# EAGLE design Particle2WeMos (EAGLE 7.5.0)
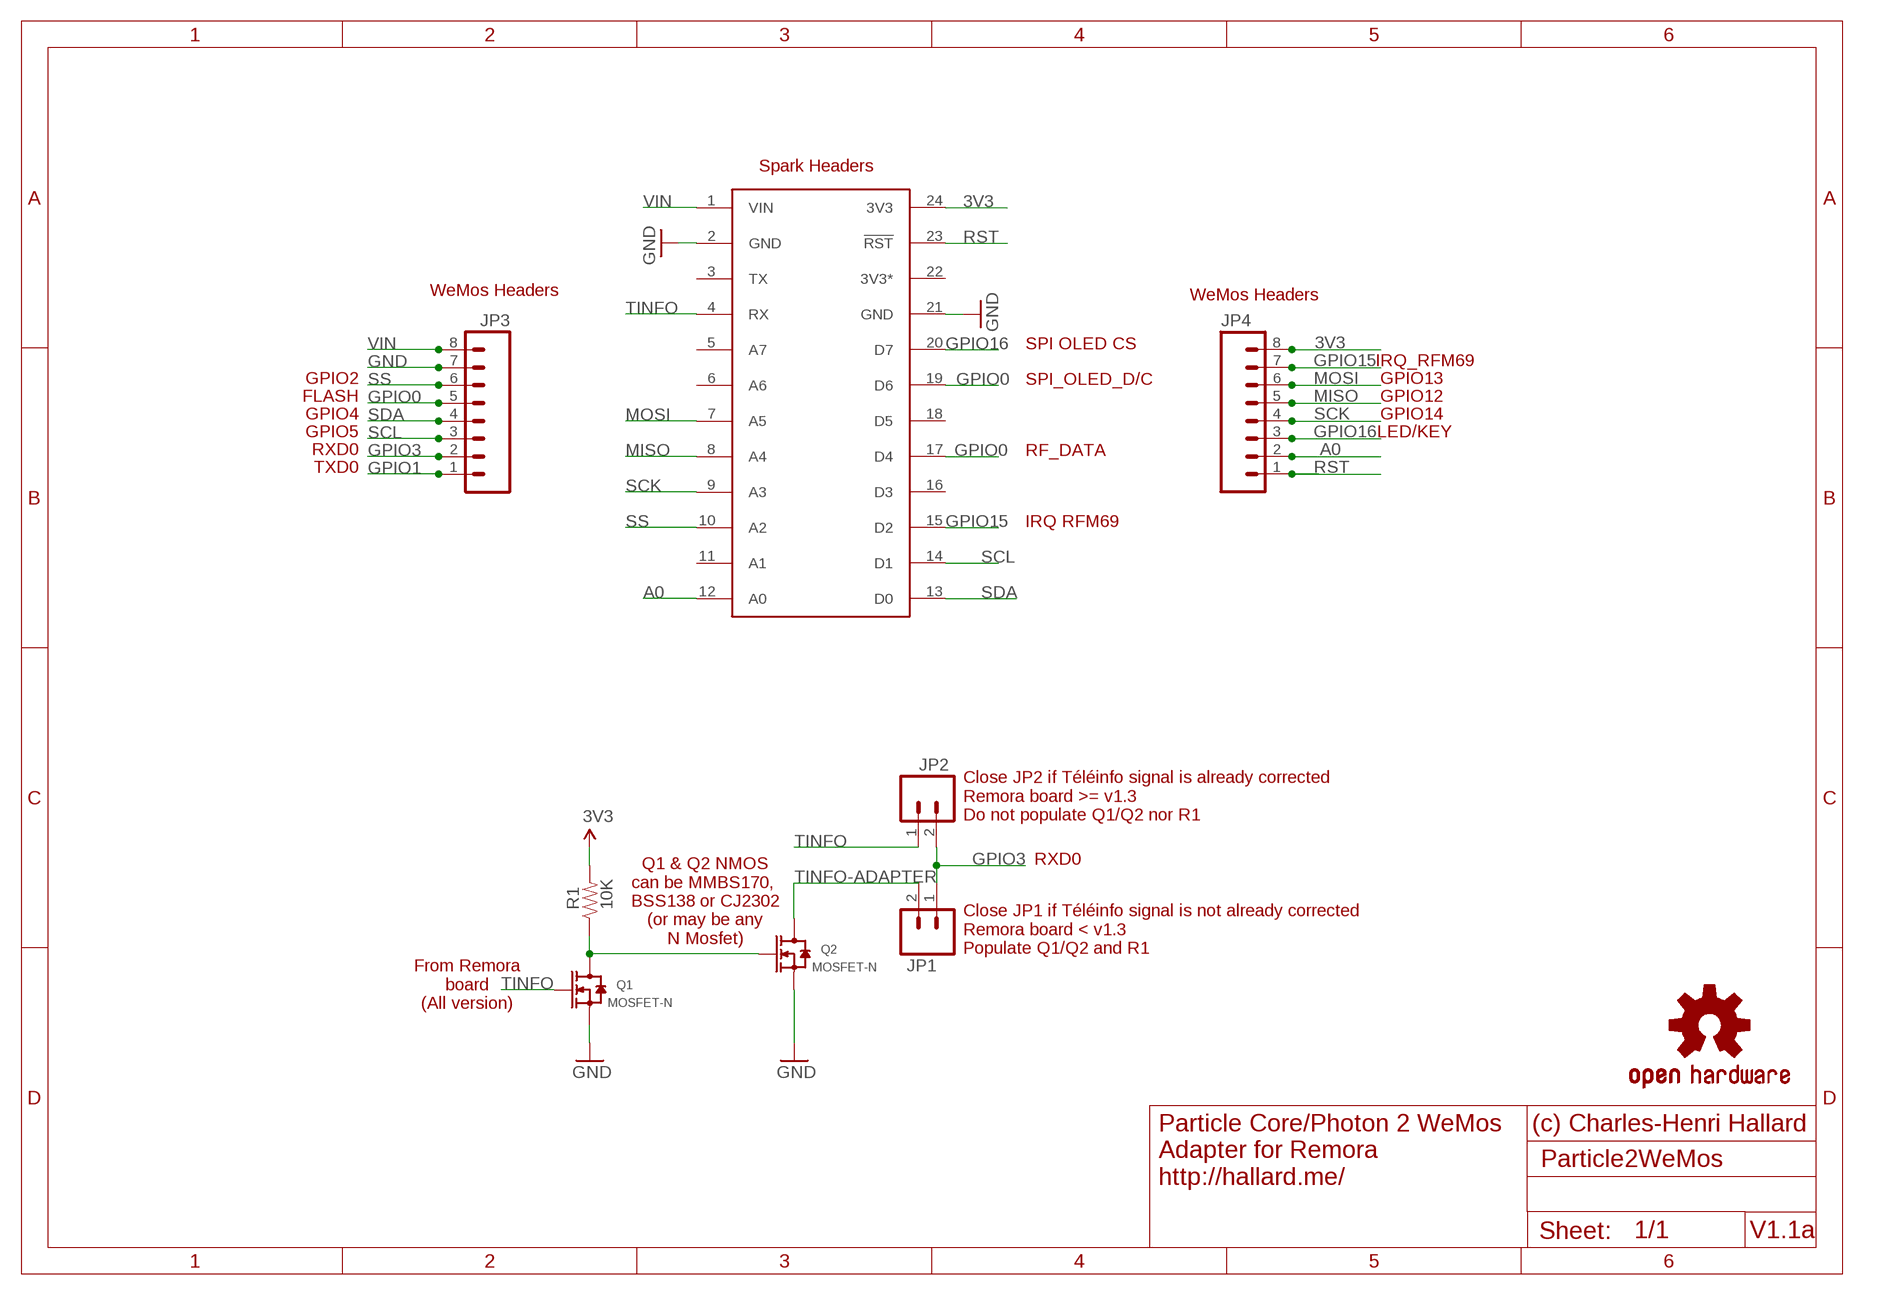
[diagram p0: schematic, sheet 1]

## Parts
JP1  M02LOCK  [1X02_LOCK]
JP2  M02LOCK  [1X02_LOCK]
JP3  M08SILK_FEMALE_PTH  [1X08]
JP4  M08SILK_FEMALE_PTH  [1X08]
LOGO1  OSHW-LOGOM  [OSHW-LOGO-M]
LOGO2  OSHW-LOGOM  [OSHW-LOGO-M]
Q1  MOSFET-N  MOSFET-N-''  [SOT23]
Q2  MOSFET-N  MOSFET-N-''  [SOT23]
R1  10K  RESISTOR0805-RES  [0805-RES]
U$2  SPARK_CORECORE  [SPARK_CORE]

## Nets
3V3: JP4.8 R1.2 U$2.24(3V3)
A0: JP4.2 U$2.12(A0)
GND: JP3.7 Q1.2(S) Q2.2(S) U$2.2(GND) U$2.21(GND)
GPIO0: JP3.5 U$2.17(D4) U$2.19(D6)
GPIO1: JP3.1
GPIO3: JP1.1 JP2.2 JP3.2
GPIO15: JP4.7 U$2.15(D2)
GPIO16: JP4.3 U$2.20(D7)
MISO: JP4.5 U$2.8(A4)
MOSI: JP4.6 U$2.7(A5)
N$3: Q1.3(D) Q2.1(G) R1.1
RST: JP4.1 U$2.23(!RST)
SCK: JP4.4 U$2.9(A3)
SCL: JP3.3 U$2.14(D1)
SDA: JP3.4 U$2.13(D0)
SS: JP3.6 U$2.10(A2)
TINFO: JP2.1 Q1.1(G) U$2.4(RX)
TINFO-ADAPTER: JP1.2 Q2.3(D)
VIN: JP3.8 U$2.1(VIN)
Unconnected: U$2.3(TX) U$2.5(A7) U$2.6(A6) U$2.11(A1) U$2.16(D3) U$2.18(D5)

## Notes on the sheet
- Spark Headers
- WeMos Headers | WeMos Headers
- SPI OLED CS | IRQ_RFM69
- GPIO2 | GPIO13
- FLASH | SPI_OLED_D/C | GPIO12
- GPIO4 | GPIO14
- GPIO5 | LED/KEY
- RXD0
- TXD0 | RF_DATA
- IRQ RFM69
- Close JP2 if Téléinfo signal is already corrected
  Remora board >= v1.3
  Do not populate Q1/Q2 nor R1
- RXD0
- Q1 & Q2 NMOS
  can be MMBS170, 
  BSS138 or CJ2302
  (or may be any
  N Mosfet)
- Close JP1 if Téléinfo signal is not already corrected
  Remora board < v1.3
  Populate Q1/Q2 and R1
- From Remora
  board
  (All version)
- (c) Charles-Henri Hallard
- Particle Core/Photon 2 WeMos
  Adapter for Remora
  http://hallard.me/
- V1.1a

## Power pins joined to a net without a drawn wire
3V3*: U$2.22(3V3*)

## Library data of the parts
JP1 JP2 = SparkFun-Connectors:M02: Standard 2-pin 0.1" header. Use with - straight break away headers ( PRT-00116) - right angle break away headers (PRT-00553) - swiss pins (PRT-00743) - machine pins (PRT-00117) - female headers (PRT-00115) Molex polarized connector foot print use with: PRT-08233 with associated crimp pins and housings. 2.54_SCREWTERM for use with PRT-10571. 3.5mm Screw Terminal footprints for PRT-08084 5mm Screw Terminal footprints for use with PRT-08432
JP3 JP4 = SparkFun-Connectors:M08: Header 8 Standard 8-pin 0.1" header. Use with straight break away headers (SKU : PRT-00116), right angle break away headers (PRT-00553), swiss pins (PRT-00743), machine pins (PRT-00117), and female headers (PRT-00115).; PROD_ID: CONN-08438
LOGO1 LOGO2 = SparkFun-Aesthetics:OSHW-LOGO: Open Source Hardware Logo This logo indicates the piece of hardware it is found on incorporates a OSHW license and/or adheres to the definition of open source hardware found here: http://freedomdefined.org/OSHW
Q1 Q2 = Seeed-Discrete:MOSFET-N: CJ2302：SMD MOSFET N-CH 20V-2.1A
R1 = _c2h:RESISTOR: Resistor Basic schematic elements and footprints for 0603, 1206, and PTH resistors.
U$2 = Spark:SPARK_CORE

## Board
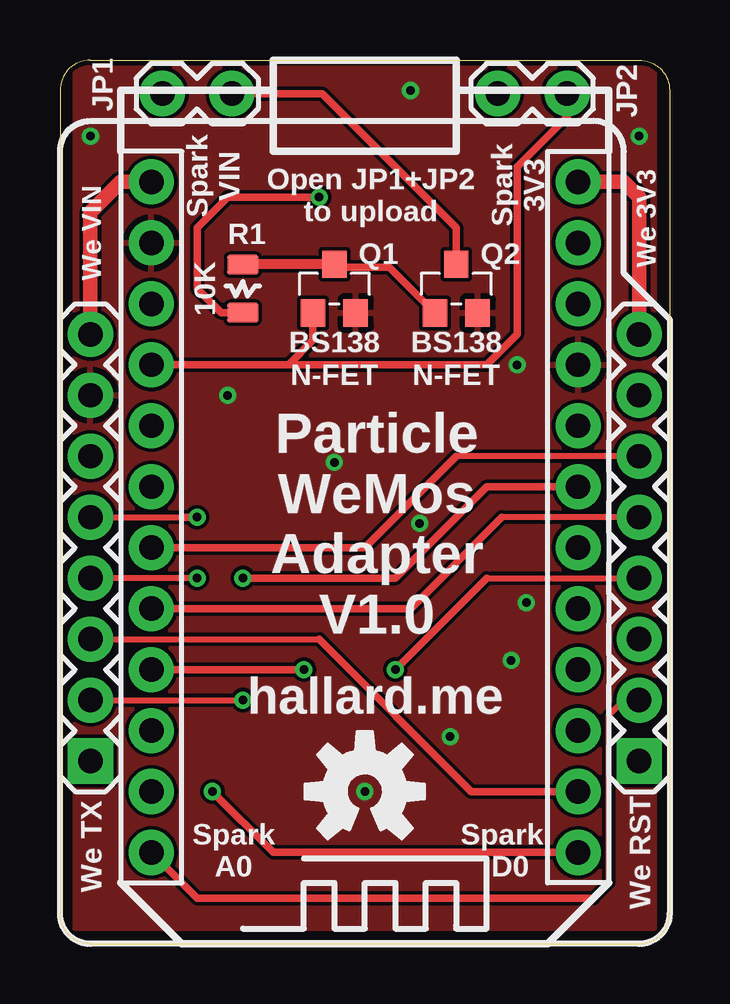
[diagram p1: board, top side]
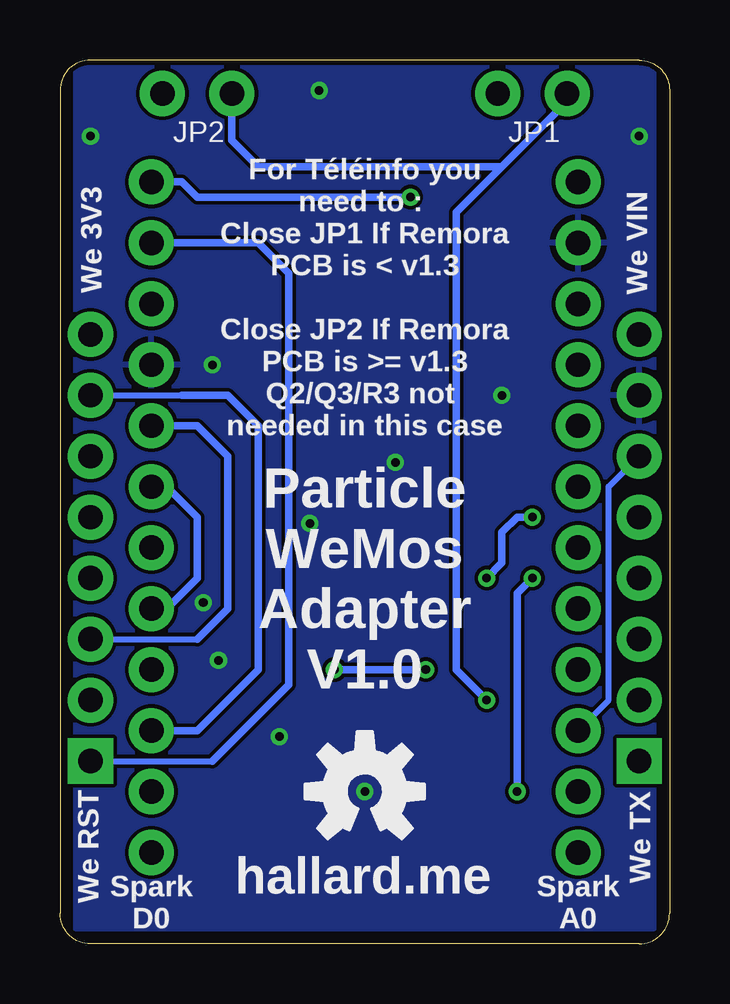
[diagram p2: board, bottom side, seen from below]

Size 25.4 x 36.83 mm. Coordinates in mm from the lower left corner, seen from the top.
Outline: 1.27,0 24.13,0 arc90 25.4,1.27 25.4,35.56 arc90 24.13,36.83 1.27,36.83 arc90 0,35.56 0,1.27 arc90 1.27,0
Copper layers (1*16): Top 0.035mm / dielectric 1.5mm / Bottom 0.035mm
Design rules "ElectroDragon_2layer_DRU_no_angle_20140221": minimum track width 6mil, minimum drill 12mil, track to track 6mil, track to pad 6mil, pad to pad 6mil, via to via 6mil, smd to smd 6mil, copper to edge 8mil, drill to drill 6mil, minimum pad ring 10mil, minimum via ring 6mil, stop-mask expansion 4mil, vias tented up to drill 100mil, thermal gap 10mil

### Footprints (pad centres in the part's own frame; a part is rotated, then mirrored left to right if it is on the bottom)
1X02_LOCK = drill 1.016 pad 1.88: 1 -0.178,0; 2 2.718,0
1X08 = drill 1.016 pad 1.88 square: 1 0,0 | drill 1.016 pad 1.88: 2 2.54,0; 3 5.08,0; 4 7.62,0; 5 10.16,0; 6 12.7,0; 7 15.24,0; 8 17.78,0
SOT23 = smd 1.016 x 1.143: 1 -0.889,-1.016; 2 0.889,-1.016; 3 0,1.016
0805-RES = smd 0.8 x 1.3: 1 -1,0; 2 1,0
SPARK_CORE = drill 1.016 pad 1.88: 1 -8.89,13.97; 2 -8.89,11.43; 3 -8.89,8.89; 4 -8.89,6.35; 5 -8.89,3.81; 6 -8.89,1.27; 7 -8.89,-1.27; 8 -8.89,-3.81; 9 -8.89,-6.35; 10 -8.89,-8.89; 11 -8.89,-11.43; 12 -8.89,-13.97; 13 8.89,-13.97; 14 8.89,-11.43; 15 8.89,-8.89; 16 8.89,-6.35; 17 8.89,-3.81; 18 8.89,-1.27; 19 8.89,1.27; 20 8.89,3.81; 21 8.89,6.35; 22 8.89,8.89; 23 8.89,11.43; 24 8.89,13.97

### Placement (x,y rotation side)
JP1  4.45,35.43 0 top
JP2  20.95,35.43 180 top
JP3  1.27,7.62 90 top
JP4  24.13,7.62 90 top
LOGO1  12.7,6.35 0 top
LOGO2  12.7,6.35 0 bottom
Q1  11.43,27.3 0 top
Q2  16.51,27.3 0 top
R1  7.62,27.3 270 top
U$2  12.7,17.78 0 top

### Tracks (layer width: path | path; a pad name or v marks a point on that pad's centre or on a via)
3V3  (via drill 0.36 pad 0.71)
  Top 0.305: v10.79,31.11 6.99,31.11 5.71,29.84 5.71,27.3 6.71,26.3 R1.2
  Top 0.61: U$2.24 23.5,31.75 24.13,31.11 JP4.8
  Bottom 0.305: U$2.24 20.32,31.75 19.68,31.11 v10.79,31.11
A0
  Top 0.254: 22.23,1.91 22.86,2.54 22.86,9.53 23.5,10.16
  Top 0.305: U$2.12 5.71,1.91 22.23,1.91 | 23.5,10.16 JP4.2
GND  (via drill 0.36 pad 0.71)
  other vias: 12.7,6.35 14.61,35.56 24.13,33.66 1.27,33.66 6.99,22.86 19.05,24.13 11.43,20.07 14.99,17.53 16.26,8.64 18.8,11.81 19.43,14.22
  pour Top: 0.64,38.1 24.77,38.1 24.77,0.64 0.64,0.64
  pour Bottom: 0.64,37.47 24.77,37.47 24.77,0.64 0.64,0.64
GPIO0  (via drill 0.36 pad 0.71)
  Top 0.254: JP3.5 5.08,17.78
  Top 0.305: 5.08,17.78 v5.71,17.78 | v7.62,15.24 13.97,15.24 17.78,19.05 U$2.19
  Bottom 0.305: U$2.17 20.95,13.97 19.68,15.24 19.68,17.78 20.95,19.05 U$2.19 | v5.71,17.78 6.35,17.78 6.99,17.14 6.99,15.88 v7.62,15.24
GPIO3  (via drill 0.36 pad 0.71)
  Top 0.254: JP3.2 v7.62,10.16
  Bottom 0.305: JP2.2 18.24,33.48 17.14,32.38 6.99,32.38 | v7.62,10.16 8.89,11.43 8.89,30.48 6.99,32.38 | JP1.1 4.27,35.1 6.99,32.38
GPIO15
  Bottom 0.254: JP4.7 20.32,22.86
  Bottom 0.305: 20.32,22.86 18.41,22.86 17.14,21.59 17.14,11.43 19.68,8.89 U$2.15
GPIO16
  Bottom 0.254: JP4.3 19.68,12.7
  Bottom 0.305: 19.68,12.7 18.41,13.97 18.41,20.32 19.68,21.59 U$2.20
MISO
  Top 0.254: JP4.5 18.41,17.78
  Top 0.305: 18.41,17.78 14.61,13.97 U$2.8
MOSI
  Top 0.254: JP4.6 16.51,20.32
  Top 0.305: 16.51,20.32 12.7,16.51 U$2.7
N$3
  Top 0.305: Q1.3 11.56,28.19 13.72,28.19 Q2.1
  Top 0.406: Q1.3 7.64,28.32 R1.1
RST
  Bottom 0.254: JP4.1 19.05,7.62
  Bottom 0.305: 19.05,7.62 15.88,10.79 15.88,27.94 17.14,29.21 U$2.23
SCK  (via drill 0.36 pad 0.71)
  Top 0.254: 17.78,15.24 JP4.4
  Top 0.305: U$2.9 v10.16,11.43 | v13.97,11.43 17.78,15.24
  Bottom 0.305: v10.16,11.43 v13.97,11.43
SCL
  Top 0.254: JP3.3 10.79,12.7
  Top 0.305: 10.79,12.7 17.14,6.35 U$2.14
SDA  (via drill 0.36 pad 0.71)
  Top 0.254: v5.71,15.24 JP3.4
  Top 0.305: U$2.13 8.89,3.81 v6.35,6.35
  Bottom 0.305: v6.35,6.35 6.35,14.61 v5.71,15.24
SS
  Bottom 0.254: U$2.10 2.54,10.16 2.54,19.05 JP3.6
TINFO
  Top 0.305: U$2.4 9.53,24.13 | 9.53,24.13 10.54,25.15 Q1.1 | JP2.1 21.13,34.47 19.05,32.38 19.05,25.4 17.78,24.13 9.53,24.13
TINFO-ADAPTER
  Top 0.305: JP1.2 10.92,35.43 16.51,29.84 Q2.3
VIN
  Top 0.61: U$2.1 2.54,31.75 1.27,30.48 JP3.8

### Text on the board
tPlace: Spark / VIN | Spark / 3V3 | Open JP1+JP2 / to upload | BS138 | BS138 | N-FET | N-FET | Particle / WeMos / Adapter / V1.0 | hallard.me | We TX | We RST | Spark / A0 | Spark / D0
bPlace: JP1 | JP2 | We VIN | We 3V3 | For Téléinfo you / need to : / Close JP1 If Remora / PCB is < v1.3 / / Close JP2 If Remora / PCB is >= v1.3 / Q2/Q3/R3 not / needed in this case | Particle / WeMos / Adapter / V1.0 | We TX | We RST | hallard.me | Spark / A0 | Spark / D0
tNames: JP1 | JP2 | We VIN | We 3V3 | R1 | Q1 | Q2